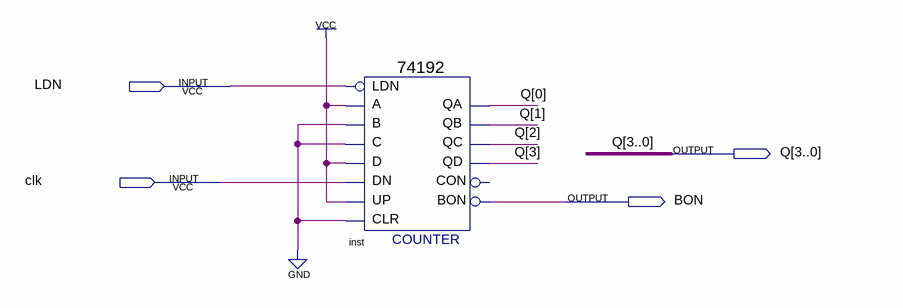
[diagram p0: schematic sheet]
// Quartus schematic lab1.bdf as structural Verilog: 1 symbols, 4 pins
module lab1 (
  input  LDN,
  input  clk,
  output [3:0] Q,
  output BON
);

  \74192  inst (
    .D(1'b1), .C(1'b0), .A(1'b1), .B(1'b0), .CLR(1'b0), .UP(1'b1), .DN(clk), .LDN(LDN), .QB(Q[1]), .BON(BON),
    .QA(Q[0]), .QC(Q[2]), .QD(Q[3]));  // open: CON
endmodule
